# EAGLE design untitled (EAGLE 9.6.2)
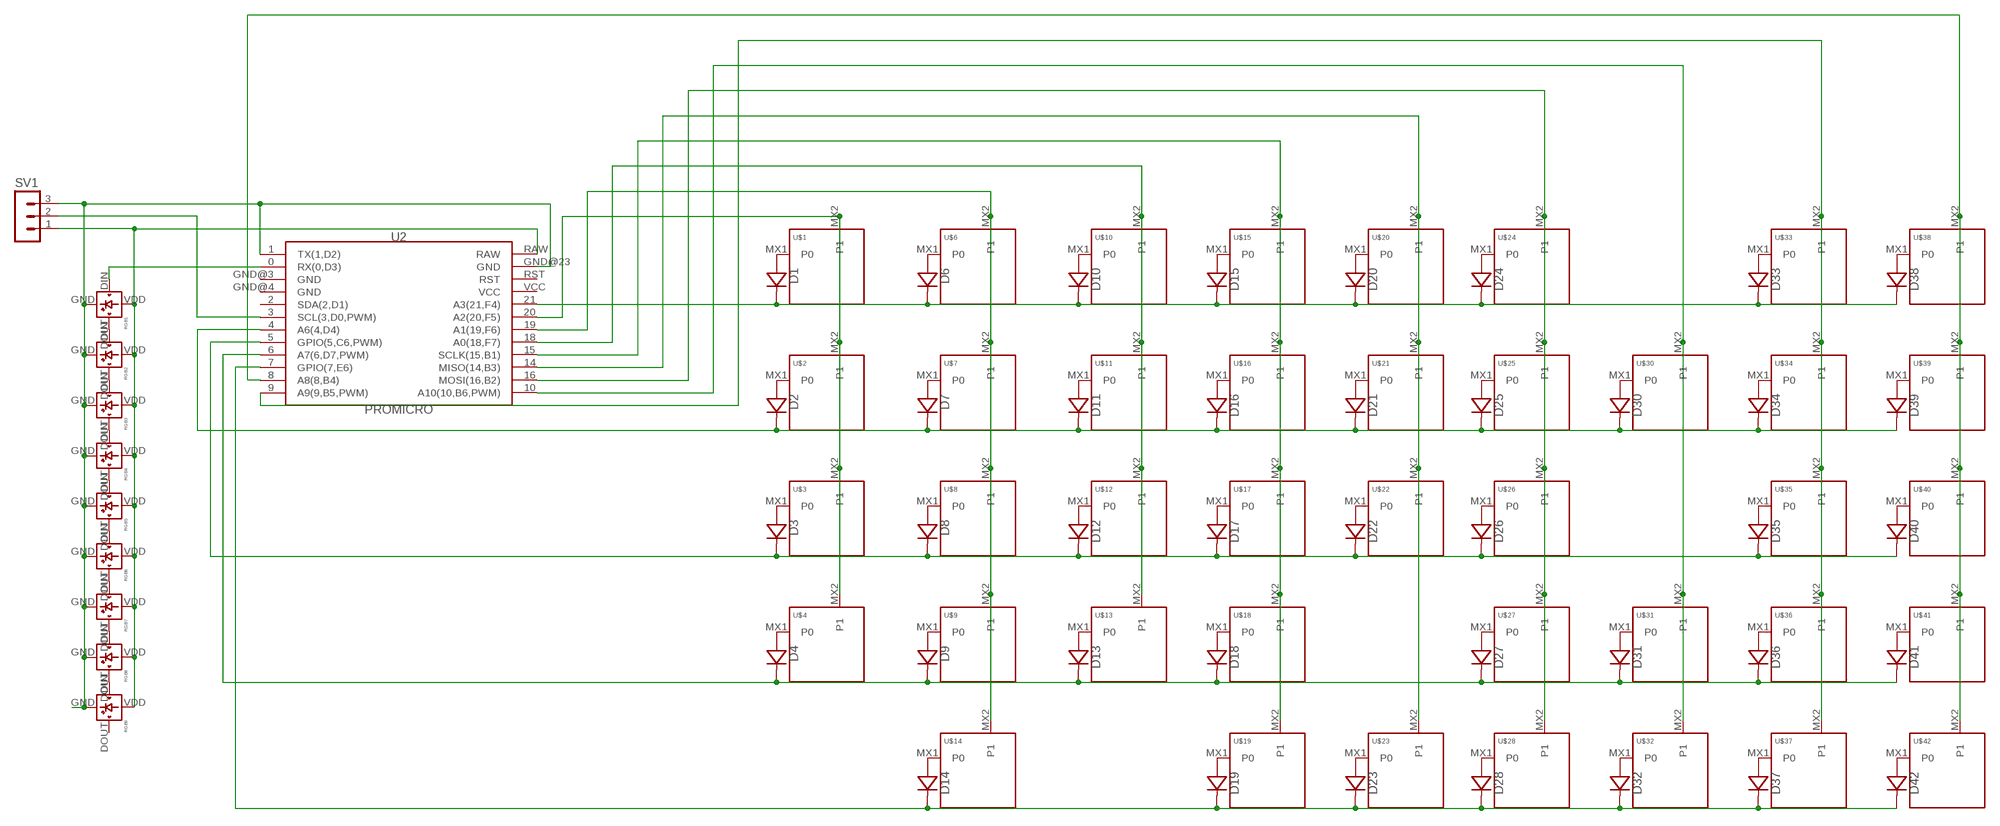
[diagram p0: schematic, sheet 1]

## Parts
D1  DIODE-SOD-123  [SOD-123]
D2  DIODE-SOD-123  [SOD-123]
D3  DIODE-SOD-123  [SOD-123]
D4  DIODE-SOD-123  [SOD-123]
D6  DIODE-SOD-123  [SOD-123]
D7  DIODE-SOD-123  [SOD-123]
D8  DIODE-SOD-123  [SOD-123]
D9  DIODE-SOD-123  [SOD-123]
D10  DIODE-SOD-123  [SOD-123]
D11  DIODE-SOD-123  [SOD-123]
D12  DIODE-SOD-123  [SOD-123]
D13  DIODE-SOD-123  [SOD-123]
D14  DIODE-SOD-123  [SOD-123]
D15  DIODE-SOD-123  [SOD-123]
D16  DIODE-SOD-123  [SOD-123]
D17  DIODE-SOD-123  [SOD-123]
D18  DIODE-SOD-123  [SOD-123]
D19  DIODE-SOD-123  [SOD-123]
D20  DIODE-SOD-123  [SOD-123]
D21  DIODE-SOD-123  [SOD-123]
D22  DIODE-SOD-123  [SOD-123]
D23  DIODE-SOD-123  [SOD-123]
D24  DIODE-SOD-123  [SOD-123]
D25  DIODE-SOD-123  [SOD-123]
D26  DIODE-SOD-123  [SOD-123]
D27  DIODE-SOD-123  [SOD-123]
D28  DIODE-SOD-123  [SOD-123]
D30  DIODE-SOD-123  [SOD-123]
D31  DIODE-SOD-123  [SOD-123]
D32  DIODE-SOD-123  [SOD-123]
D33  DIODE-SOD-123  [SOD-123]
D34  DIODE-SOD-123  [SOD-123]
D35  DIODE-SOD-123  [SOD-123]
D36  DIODE-SOD-123  [SOD-123]
D37  DIODE-SOD-123  [SOD-123]
D38  DIODE-SOD-123  [SOD-123]
D39  DIODE-SOD-123  [SOD-123]
D40  DIODE-SOD-123  [SOD-123]
D41  DIODE-SOD-123  [SOD-123]
D42  DIODE-SOD-123  [SOD-123]
RGB1  WS2812B-MINI  [WS2812B-MINI]
RGB2  WS2812B-MINI  [WS2812B-MINI]
RGB3  WS2812B-MINI  [WS2812B-MINI]
RGB4  WS2812B-MINI  [WS2812B-MINI]
RGB5  WS2812B-MINI  [WS2812B-MINI]
RGB6  WS2812B-MINI  [WS2812B-MINI]
RGB7  WS2812B-MINI  [WS2812B-MINI]
RGB8  WS2812B-MINI  [WS2812B-MINI]
RGB9  WS2812B-MINI  [WS2812B-MINI]
SV1  MA03-1  [MA03-1]
U2  PROMICRO  [PROMICRO]
U$1  KEYSWITCH-PLAIN-MX-1U  [MX-1U]
U$2  KEYSWITCH-PLAIN-MX-1U  [MX-1U]
U$3  KEYSWITCH-PLAIN-MX-1U  [MX-1U]
U$4  KEYSWITCH-PLAIN-MX-1U  [MX-1U]
U$6  KEYSWITCH-PLAIN-MX-1U  [MX-1U]
U$7  KEYSWITCH-PLAIN-MX-1U  [MX-1U]
U$8  KEYSWITCH-PLAIN-MX-1U  [MX-1U]
U$9  KEYSWITCH-PLAIN-MX-1U  [MX-1U]
U$10  KEYSWITCH-PLAIN-MX-1U  [MX-1U]
U$11  KEYSWITCH-PLAIN-MX-1U  [MX-1U]
U$12  KEYSWITCH-PLAIN-MX-1U  [MX-1U]
U$13  KEYSWITCH-PLAIN-MX-1U  [MX-1U]
U$14  KEYSWITCH-PLAIN-MX-1U  [MX-1U]
U$15  KEYSWITCH-PLAIN-MX-1U  [MX-1U]
U$16  KEYSWITCH-PLAIN-MX-1U  [MX-1U]
U$17  KEYSWITCH-PLAIN-MX-1U  [MX-1U]
U$18  KEYSWITCH-PLAIN-MX-1U  [MX-1U]
U$19  KEYSWITCH-PLAIN-MX-1U  [MX-1U]
U$20  KEYSWITCH-PLAIN-MX-1U  [MX-1U]
U$21  KEYSWITCH-PLAIN-MX-1U  [MX-1U]
U$22  KEYSWITCH-PLAIN-MX-1U  [MX-1U]
U$23  KEYSWITCH-PLAIN-MX-1U  [MX-1U]
U$24  KEYSWITCH-PLAIN-MX-1U  [MX-1U]
U$25  KEYSWITCH-PLAIN-MX-1U  [MX-1U]
U$26  KEYSWITCH-PLAIN-MX-1U  [MX-1U]
U$27  KEYSWITCH-PLAIN-MX-1U  [MX-1U]
U$28  KEYSWITCH-PLAIN-MX-1U  [MX-1U]
U$30  KEYSWITCH-PLAIN-MX-1U  [MX-1U]
U$31  KEYSWITCH-PLAIN-MX-1U  [MX-1U]
U$32  KEYSWITCH-PLAIN-MX-1U  [MX-1U]
U$33  KEYSWITCH-PLAIN-MX-1U  [MX-1U]
U$34  KEYSWITCH-PLAIN-MX-1U  [MX-1U]
U$35  KEYSWITCH-PLAIN-MX-1U  [MX-1U]
U$36  KEYSWITCH-PLAIN-MX-1U  [MX-1U]
U$37  KEYSWITCH-PLAIN-MX-1U  [MX-1U]
U$38  KEYSWITCH-PLAIN-MX-1U  [MX-1U]
U$39  KEYSWITCH-PLAIN-MX-1U  [MX-1U]
U$40  KEYSWITCH-PLAIN-MX-1U  [MX-1U]
U$41  KEYSWITCH-PLAIN-MX-1U  [MX-1U]
U$42  KEYSWITCH-PLAIN-MX-1U  [MX-1U]

## Nets
N$1: D1.A U$1.MX1(P0)
N$2: D2.A U$2.MX1(P0)
N$3: D3.A U$3.MX1(P0)
N$4: D4.A U$4.MX1(P0)
N$5: RGB1.DOUT RGB2.DIN
N$6: D6.A U$6.MX1(P0)
N$7: D7.A U$7.MX1(P0)
N$8: D8.A U$8.MX1(P0)
N$9: D9.A U$9.MX1(P0)
N$10: D10.A U$10.MX1(P0)
N$11: D11.A U$11.MX1(P0)
N$12: D12.A U$12.MX1(P0)
N$13: D13.A U$13.MX1(P0)
N$14: D14.A U$14.MX1(P0)
N$15: D15.A U$15.MX1(P0)
N$16: D16.A U$16.MX1(P0)
N$17: D17.A U$17.MX1(P0)
N$18: D18.A U$18.MX1(P0)
N$19: D19.A U$19.MX1(P0)
N$20: D20.A U$20.MX1(P0)
N$21: D21.A U$21.MX1(P0)
N$22: D22.A U$22.MX1(P0)
N$23: D23.A U$23.MX1(P0)
N$24: D24.A U$24.MX1(P0)
N$25: D25.A U$25.MX1(P0)
N$26: D26.A U$26.MX1(P0)
N$27: D27.A U$27.MX1(P0)
N$28: D28.A U$28.MX1(P0)
N$29: RGB2.DOUT RGB3.DIN
N$30: D30.A U$30.MX1(P0)
N$31: D31.A U$31.MX1(P0)
N$32: D32.A U$32.MX1(P0)
N$33: D33.A U$33.MX1(P0)
N$34: D34.A U$34.MX1(P0)
N$35: D35.A U$35.MX1(P0)
N$36: D36.A U$36.MX1(P0)
N$37: D37.A U$37.MX1(P0)
N$38: D38.A U$38.MX1(P0)
N$39: D39.A U$39.MX1(P0)
N$40: D40.A U$40.MX1(P0)
N$41: D41.A U$41.MX1(P0)
N$42: D42.A U$42.MX1(P0)
N$43: U2.20(A2(20,F5)) U$1.MX2(P1) U$2.MX2(P1) U$3.MX2(P1) U$4.MX2(P1)
N$44: U2.19(A1(19,F6)) U$6.MX2(P1) U$7.MX2(P1) U$8.MX2(P1) U$9.MX2(P1) U$14.MX2(P1)
N$45: U2.18(A0(18,F7)) U$10.MX2(P1) U$11.MX2(P1) U$12.MX2(P1) U$13.MX2(P1)
N$46: U2.15(SCLK(15,B1)) U$15.MX2(P1) U$16.MX2(P1) U$17.MX2(P1) U$18.MX2(P1) U$19.MX2(P1)
N$47: U2.14(MISO(14,B3)) U$20.MX2(P1) U$21.MX2(P1) U$22.MX2(P1) U$23.MX2(P1)
N$48: U2.16(MOSI(16,B2)) U$24.MX2(P1) U$25.MX2(P1) U$26.MX2(P1) U$27.MX2(P1) U$28.MX2(P1)
N$49: U2.10(A10(10,B6,PWM)) U$30.MX2(P1) U$31.MX2(P1) U$32.MX2(P1)
N$50: U2.9(A9(9,B5,PWM)) U$33.MX2(P1) U$34.MX2(P1) U$35.MX2(P1) U$36.MX2(P1) U$37.MX2(P1)
N$51: D1.C D6.C D10.C D15.C D20.C D24.C D33.C D38.C U2.21(A3(21,F4))
N$52: D2.C D7.C D11.C D16.C D21.C D25.C D30.C D34.C D39.C U2.4(A6(4,D4))
N$53: D3.C D8.C D12.C D17.C D22.C D26.C D35.C D40.C U2.5(GPIO(5,C6,PWM))
N$54: D4.C D9.C D13.C D18.C D27.C D31.C D36.C D41.C U2.6(A7(6,D7,PWM))
N$55: D14.C D19.C D23.C D28.C D32.C D37.C D42.C U2.7(GPIO(7,E6))
N$56: U2.8(A8(8,B4)) U$38.MX2(P1) U$39.MX2(P1) U$40.MX2(P1) U$41.MX2(P1) U$42.MX2(P1)
N$57: RGB3.DOUT RGB4.DIN
N$58: RGB4.DOUT RGB5.DIN
N$59: RGB5.DOUT RGB6.DIN
N$60: RGB6.DOUT RGB7.DIN
N$61: RGB7.DOUT RGB8.DIN
N$62: RGB8.DOUT RGB9.DIN
N$63: RGB1.VDD RGB2.VDD RGB3.VDD RGB4.VDD RGB5.VDD RGB6.VDD RGB7.VDD RGB8.VDD RGB9.VDD SV1.1 U2.RAW
N$64: RGB1.GND RGB2.GND RGB3.GND RGB4.GND RGB5.GND RGB6.GND RGB7.GND RGB8.GND RGB9.GND SV1.3 U2.1(TX(1,D2)) U2.GND@23(GND)
N$65: RGB1.DIN U2.0(RX(0,D3))
N$66: SV1.2 U2.3(SCL(3,D0,PWM))
Unconnected: RGB9.DOUT U2.2(SDA(2,D1)) U2.GND@3(GND) U2.GND@4(GND) U2.RST U2.VCC

## Library data of the parts
D1-D4 D6-D28 D30-D42 = Controller:DIODE: Standard 1N4148 diode
RGB1-RGB9 = Controller:WS2812B
SV1 = con-lstb:MA03-1: PIN HEADER; OC_FARNELL: unknown; OC_NEWARK: unknown
U2 = Controller:PROMICRO
U$1-U$4 U$6-U$28 U$30-U$42 = Keyboard:KEYSWITCH-PLAIN

## Board
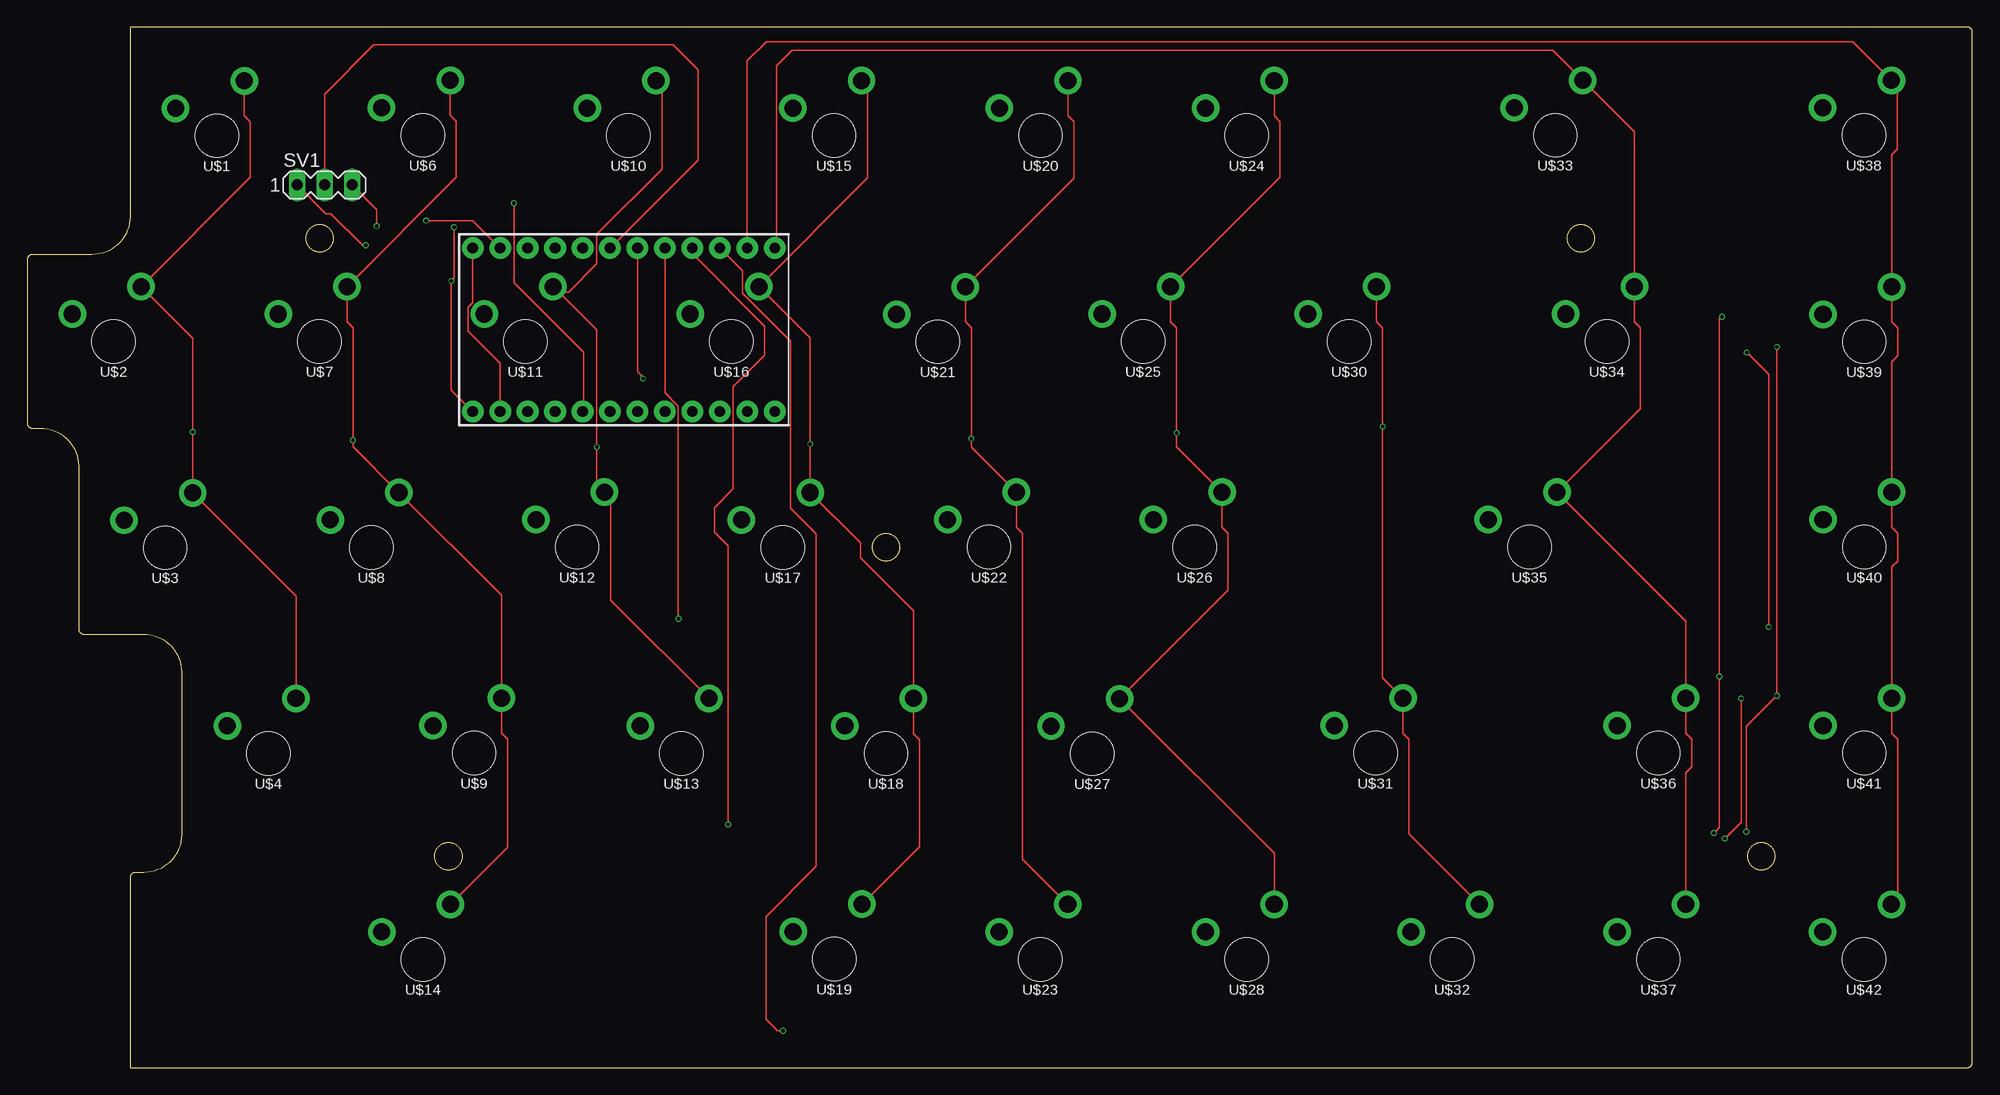
[diagram p1: board, top side]
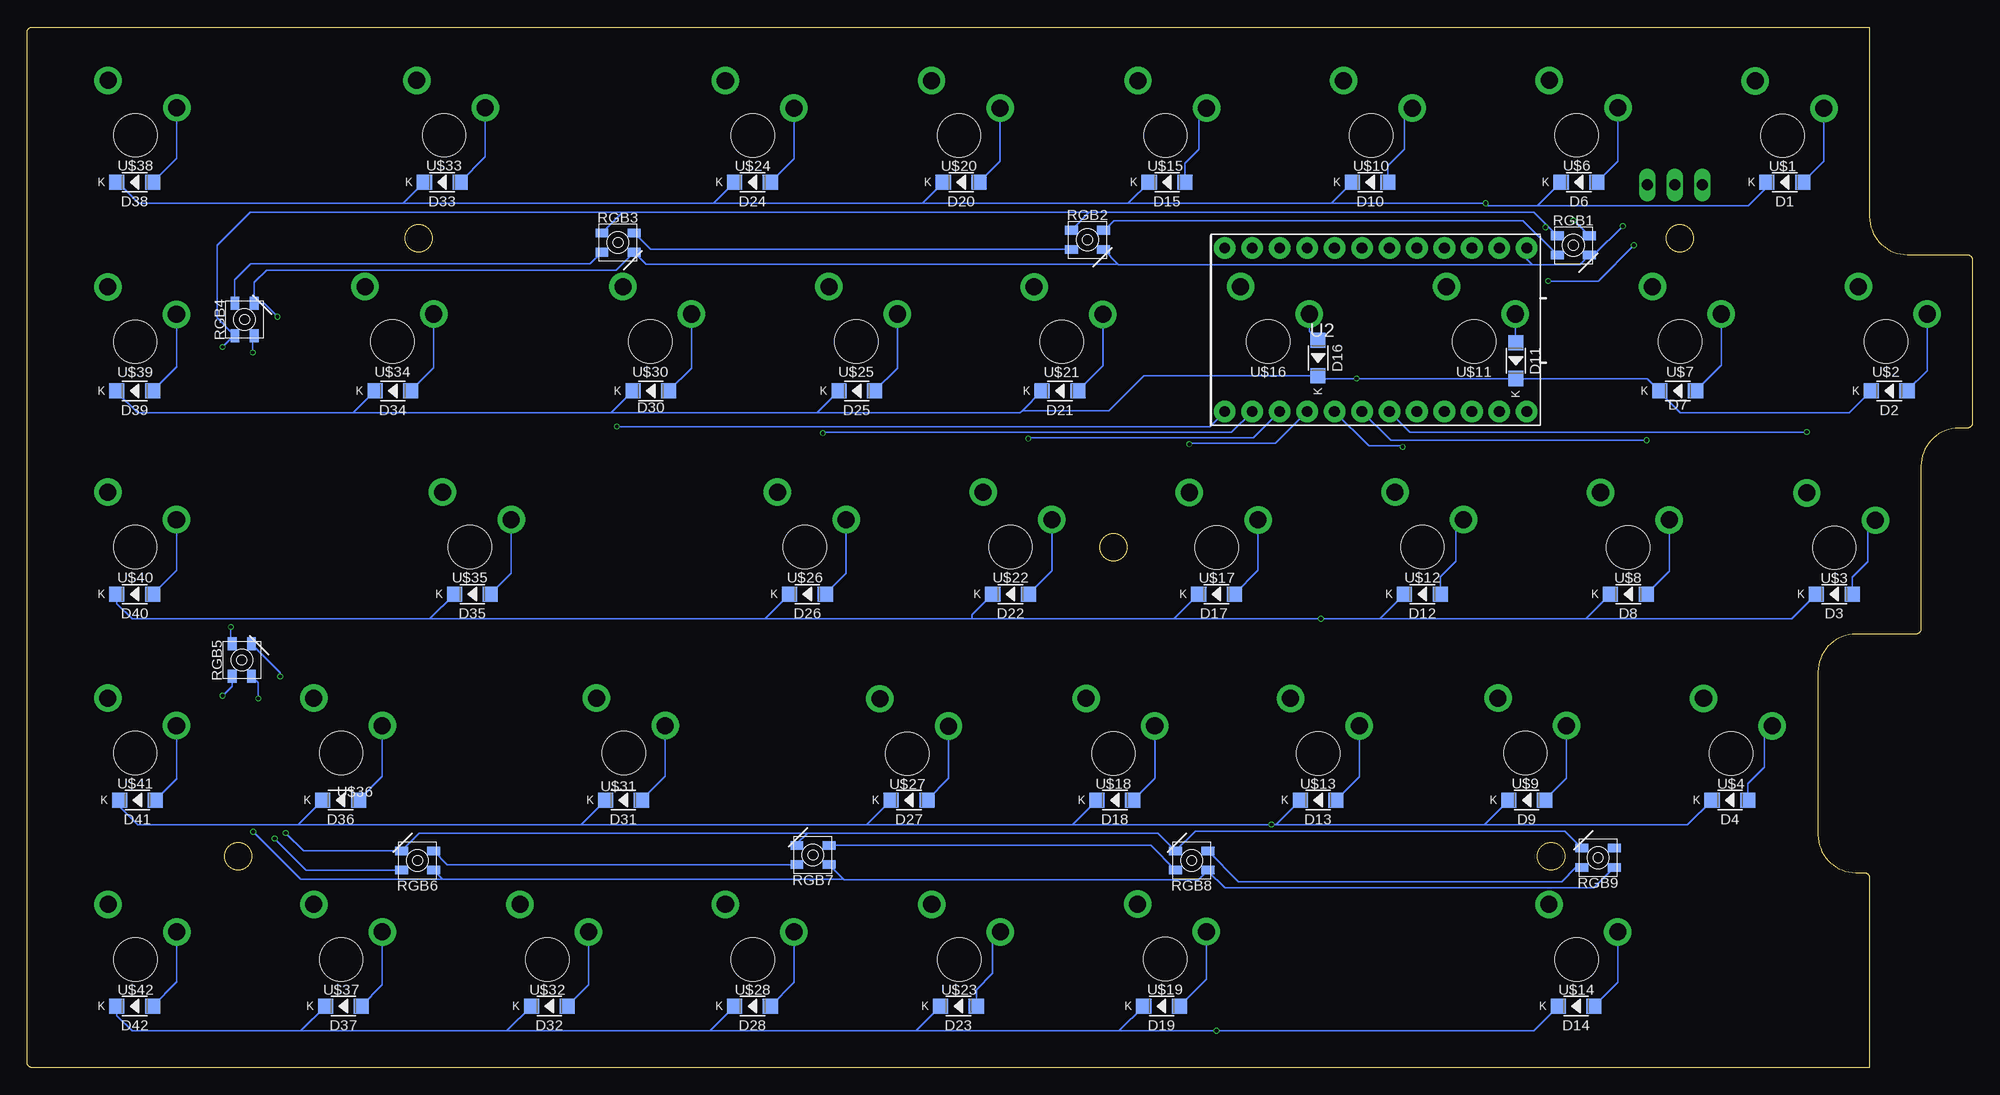
[diagram p2: board, bottom side, seen from below]

Size 179.98 x 96.25 mm. Coordinates in mm from the lower left corner, seen from the top.
Outline: 179.45,96.25 9.53,96.25 9.53,78.7 arc-90 6.03,75.2 0.5,75.2 arc90 0,74.7 0,59.65 arc90 0.5,59.15 1.26,59.15 arc-90 4.76,55.65 4.76,40.6 arc90 5.26,40.1 10.79,40.1 arc-90 14.29,36.6 14.29,21.55 arc-90 10.79,18.05 10.03,18.05 arc90 9.53,17.55 9.53,0 179.45,0 179.52,0 179.56,0.01 179.59,0.01 179.63,0.02 179.67,0.04 179.71,0.06 179.74,0.07 179.77,0.09 179.8,0.12 179.83,0.14 179.85,0.17 179.88,0.21 179.9,0.24 179.92,0.27 179.94,0.31 179.95,0.35 179.96,0.38 179.97,0.42 179.97,0.46 179.98,0.53 179.98,95.72 179.97,95.79 179.97,95.83 179.96,95.87 179.95,95.9 179.94,95.94 179.92,95.98 179.9,96.01 179.88,96.04 179.85,96.08 179.83,96.1 179.8,96.13 179.77,96.15 179.74,96.17 179.71,96.19 179.67,96.21 179.63,96.22 179.59,96.23 179.55,96.24 179.52,96.25 179.45,96.25
Outline: circle at 27.07,76.7 radius 1.25
Outline: circle at 143.76,76.7 radius 1.25
Outline: circle at 160.43,19.55 radius 1.25
Outline: circle at 38.98,19.55 radius 1.25
Outline: circle at 79.46,48.12 radius 1.25
Copper layers (1*16): Top 0.035559375mm / dielectric 1.6mm / Bottom 0.035559375mm
Design rules "jlcpcb2layer": minimum track width 5mil, minimum drill 12mil, track to track 5mil, track to pad 5mil, pad to pad 5mil, via to via 5mil, smd to smd 5mil, copper to edge 8mil, drill to drill 6mil, minimum pad ring 5mil, minimum via ring 3mil, stop-mask expansion 2.5mil, vias tented up to drill 0mil, thermal gap 10mil

### Footprints (pad centres in the part's own frame; a part is rotated, then mirrored left to right if it is on the bottom)
SOD-123 = smd 1.397 x 1.397: A -1.651,0; C 1.651,0
WS2812B-MINI = smd 0.8 x 1.2: DIN 0.89,-1.49; DOUT -0.89,1.49; GND -0.89,-1.49; VDD 0.89,1.49
MA03-1 = drill 1.016 long: 1 -2.54,0; 2 0,0; 3 2.54,0
PROMICRO = drill 1 pad 2: 0 -7.62,11.43; 1 -7.62,13.97; 2 -7.62,3.81; 3 -7.62,1.27; 4 -7.62,-1.27; 5 -7.62,-3.81; 6 -7.62,-6.35; 7 -7.62,-8.89; 8 -7.62,-11.43; 9 -7.62,-13.97; 10 7.5,-13.97; 14 7.5,-8.89; 15 7.5,-6.35; 16 7.5,-11.43; 18 7.5,-3.81; 19 7.5,-1.27; 20 7.5,1.27; 21 7.5,3.81; GND@3 -7.62,8.89; GND@4 -7.62,6.35; GND@23 7.5,11.43; RAW 7.5,13.97; RST 7.5,8.89; VCC 7.5,6.35
MX-1U = drill 1.575 pad 2.54: MX1 -3.81,2.54; MX2 2.54,5.08 | hole 4: 0,0

### Placement (x,y rotation side)
D1  17.36,81.9 180 bottom
D2  7.71,62.6 180 bottom
D3  12.79,43.8 180 bottom
D4  22.44,24.75 180 bottom
D6  36.41,81.9 180 bottom
D7  27.26,62.6 180 bottom
D8  31.84,43.8 180 bottom
D9  41.23,24.75 180 bottom
D10  55.71,81.9 180 bottom
D11  42.25,65.39 270 bottom
D12  50.89,43.8 180 bottom
D13  60.54,24.75 180 bottom
D14  36.66,5.7 180 bottom
D15  74.51,81.9 180 bottom
D16  60.54,65.64 270 bottom
D17  69.94,43.8 180 bottom
D18  79.33,24.75 180 bottom
D19  75.02,5.7 180 bottom
D20  93.56,81.9 180 bottom
D21  84.41,62.6 180 bottom
D22  88.99,43.8 180 bottom
D23  93.81,5.7 180 bottom
D24  112.86,81.9 180 bottom
D25  103.21,62.6 180 bottom
D26  107.78,43.8 180 bottom
D27  98.38,24.75 180 bottom
D28  112.86,5.7 180 bottom
D30  122.26,62.6 180 bottom
D31  124.8,24.75 180 bottom
D32  131.66,5.7 180 bottom
D33  141.56,81.9 180 bottom
D34  146.14,62.6 180 bottom
D35  138.77,43.8 180 bottom
D36  150.96,24.75 180 bottom
D37  150.71,5.7 180 bottom
D38  170.01,81.9 180 bottom
D39  170.01,62.6 180 bottom
D40  170.01,43.8 180 bottom
D41  169.76,24.75 180 bottom
D42  170.01,5.7 180 bottom
RGB1  36.92,76.06 90 bottom
RGB2  81.87,76.57 90 bottom
RGB3  125.31,76.31 90 bottom
RGB4  159.85,69.2 180 bottom
RGB5  160.11,37.7 180 bottom
RGB6  143.85,19.16 270 bottom
RGB7  107.27,19.67 270 bottom
RGB8  72.22,19.16 270 bottom
RGB9  34.63,19.42 270 bottom
SV1  27.52,81.65 0 top
U2  55.2,68.18 270 bottom
U$1  17.56,86.19 0 top
U$2  8.01,67.17 0 top
U$3  12.79,48.09 0 top
U$4  22.34,29.07 0 top
U$6  36.61,86.24 0 top
U$7  27.06,67.17 0 top
U$8  31.86,48.12 0 top
U$9  41.36,29.09 0 top
U$10  55.64,86.22 0 top
U$11  46.11,67.17 0 top
U$12  50.89,48.14 0 top
U$13  60.54,29.07 0 top
U$14  36.64,10.02 0 top
U$15  74.66,86.22 0 top
U$16  65.16,67.17 0 top
U$17  69.91,48.12 0 top
U$18  79.46,29.07 0 top
U$19  74.69,10.04 0 top
U$20  93.76,86.22 0 top
U$21  84.26,67.14 0 top
U$22  88.99,48.14 0 top
U$23  93.74,10.02 0 top
U$24  112.84,86.22 0 top
U$25  103.26,67.17 0 top
U$26  108.01,48.14 0 top
U$27  98.54,29.04 0 top
U$28  112.84,10.02 0 top
U$30  122.31,67.17 0 top
U$31  124.75,29.09 0 top
U$32  131.84,10.02 0 top
U$33  141.39,86.24 0 top
U$34  146.16,67.17 0 top
U$35  139,48.14 0 top
U$36  150.91,29.09 0 top
U$37  150.91,10.02 0 top
U$38  169.94,86.24 0 top
U$39  169.96,67.14 0 top
U$40  169.96,48.14 0 top
U$41  169.96,29.09 0 top
U$42  169.94,10.02 0 top

### Tracks (layer width: path | path; a pad name or v marks a point on that pad's centre or on a via)
N$1
  Bottom 0.152: U$1.MX1 13.75,83.86 D1.A
N$2
  Bottom 0.152: U$2.MX1 4.2,64.45 D2.A
N$3
  Bottom 0.152: D3.A 11.14,45.37 9.69,46.81 9.69,49.92 U$3.MX1
N$4
  Bottom 0.152: D4.A 20.79,26.24 19.24,27.79 19.24,30.89 U$4.MX1
N$5
  Bottom 0.152: RGB2.DIN 80.38,77.36 79.4,78.34 41.58,78.34 RGB1.DOUT
N$6
  Bottom 0.152: U$6.MX1 32.8,83.86 D6.A
N$7
  Bottom 0.152: U$7.MX1 23.25,64.96 D7.A
N$8
  Bottom 0.152: U$8.MX1 28.05,45.93 D8.A
N$9
  Bottom 0.152: U$9.MX1 37.55,26.78 D9.A
N$10
  Bottom 0.152: D10.A 54.06,83.42 52.54,84.94 52.54,88.04 U$10.MX1
N$11
  Bottom 0.152: U$11.MX1 42.3,67.09 D11.A
N$12
  Bottom 0.152: D12.A 49.24,45.42 47.79,46.86 47.79,49.97 U$12.MX1
N$13
  Bottom 0.152: U$13.MX1 56.73,26.91 D13.A
N$14
  Bottom 0.152: U$14.MX1 32.83,7.88 D14.A
N$15
  Bottom 0.152: D15.A 72.86,83.65 71.57,84.94 71.57,88.04 U$15.MX1
N$16
  Bottom 0.152: U$16.MX1 61.35,68.11 D16.A
N$17
  Bottom 0.152: U$17.MX1 66.1,45.98 D17.A
N$18
  Bottom 0.152: U$18.MX1 75.65,26.78 D18.A
N$19
  Bottom 0.152: U$19.MX1 70.88,8.19 D19.A
N$20
  Bottom 0.152: U$20.MX1 89.95,83.86 D20.A
N$21
  Bottom 0.152: U$21.MX1 80.45,64.91 D21.A
N$22
  Bottom 0.152: U$22.MX1 85.18,45.96 D22.A
N$23
  Bottom 0.152: D23.A 92.16,7.22 90.64,8.74 90.64,11.84 U$23.MX1
N$24
  Bottom 0.152: U$24.MX1 109.03,84.08 D24.A
N$25
  Bottom 0.152: U$25.MX1 99.45,64.7 D25.A
N$26
  Bottom 0.152: U$26.MX1 104.2,45.73 D26.A
N$27
  Bottom 0.152: U$27.MX1 94.73,26.76 D27.A
N$28
  Bottom 0.152: U$28.MX1 109.03,7.88 D28.A
N$29
  Bottom 0.152: RGB2.DOUT 122.29,75.68 RGB3.DIN
N$30
  Bottom 0.152: U$30.MX1 118.5,64.7 D30.A
N$31
  Bottom 0.152: U$31.MX1 120.94,26.96 D31.A
N$32
  Bottom 0.152: U$32.MX1 128.03,7.68 D32.A
N$33
  Bottom 0.152: U$33.MX1 137.58,84.24 D33.A
N$34
  Bottom 0.152: U$34.MX1 142.35,64.73 D34.A
N$35
  Bottom 0.152: U$35.MX1 135.19,45.73 D35.A
N$36
  Bottom 0.152: U$36.MX1 147.1,26.96 D36.A
N$37
  Bottom 0.152: U$37.MX1 147.1,7.66 D37.A
N$38
  Bottom 0.152: U$38.MX1 166.13,84.14 D38.A
N$39
  Bottom 0.152: U$39.MX1 166.15,64.81 D39.A
N$40
  Bottom 0.152: U$40.MX1 166.15,46.01 D40.A
N$41
  Bottom 0.152: U$41.MX1 166.15,26.71 D41.A
N$42
  Bottom 0.152: U$42.MX1 166.13,7.94 D42.A
N$43  (via drill 0.35)
  Top 0.152: U$1.MX2 20.1,88.03 20.65,87.47 20.65,82.35 U$2.MX2 15.33,67.47 v15.33,58.79 U$3.MX2 24.88,43.62 U$4.MX2
  Bottom 0.152: U2.20 52.04,58.79 v15.33,58.79
N$44  (via drill 0.35)
  Top 0.152: U$6.MX2 39.15,88.08 39.7,87.52 39.7,82.35 U$7.MX2 29.6,69 30.15,68.45 v30.15,58.02 30.15,57.45 U$8.MX2 43.9,43.7 U$9.MX2 43.9,30.93 44.45,30.37 44.45,20.38 U$14.MX2
  Bottom 0.152: U2.19 53.81,58.02 v30.15,58.02
N$45  (via drill 0.35)
  Top 0.152: U$10.MX2 58.73,90.75 58.73,83.1 52.71,77.08 52.71,74.36 50.08,71.74 49.16,71.74 U$11.MX2 48.71,72.25 52.71,68.25 v52.71,57.42 52.71,54.33 53.25,53.79 53.25,53.48 53.43,53.48 U$12.MX2 53.43,52.77 53.98,52.22 53.98,43.25 U$13.MX2
  Bottom 0.152: U2.18 55.85,57.52 52.66,57.52 52.66,57.46 v52.71,57.42
N$46  (via drill 0.35)
  Top 0.152: U$15.MX2 77.26,91.3 77.75,90.8 77.75,82.3 U$16.MX2 72.45,67.5 v72.45,57.67 U$17.MX2 77.12,48.53 77.12,47.15 82,42.27 U$18.MX2 82,30.9 82.55,30.35 82.55,20.45 U$19.MX2
  Bottom 0.152: U2.15 64.47,57.77 72.48,57.77 72.48,57.7 v72.45,57.67
N$47  (via drill 0.35)
  Top 0.152: U$20.MX2 96.3,88.05 96.85,87.5 96.85,82.27 U$21.MX2 86.8,68.98 87.35,68.42 v87.35,58.18 87.35,57.4 U$22.MX2 91.53,49.98 92.08,49.42 92.08,19.3 U$23.MX2
  Bottom 0.152: U2.14 66.5,58.28 87.46,58.28 87.36,58.18 v87.35,58.18
N$48  (via drill 0.35)
  Top 0.152: U$24.MX2 115.38,88.05 115.93,87.5 115.93,82.38 U$25.MX2 105.8,69 106.35,68.45 v106.35,58.69 106.35,57.42 U$26.MX2 110.55,49.98 111.1,49.42 111.1,44.15 U$27.MX2 115.38,19.82 U$28.MX2
  Bottom 0.152: U2.16 68.53,58.79 106.26,58.79 v106.35,58.69
N$49  (via drill 0.35)
  Top 0.152: U$30.MX2 124.85,69 125.4,68.45 v125.4,59.29 125.4,36.06 U$31.MX2 127.29,30.93 127.84,30.37 127.84,21.63 U$32.MX2
  Bottom 0.152: U2.10 70.56,59.29 v125.4,59.29
N$50
  Top 0.152: U$37.MX2 153.45,27.26 154,27.81 154,30.37 153.45,30.93 U$36.MX2 153.45,41.31 U$35.MX2 149.25,60.94 149.25,68.45 148.7,69 U$34.MX2 148.7,86.55 U$33.MX2 141.16,94.09 70.76,94.09 69.35,92.68 69.35,75.98 U2.9
N$51  (via drill 0.35)
  Top 0.152: U2.21 51.49,60.78 51.49,66.16 45.04,72.61 v45.04,79.96
  Bottom 0.152: D38.C 171.61,81.9 169.66,79.96 145.16,79.96 | D1.C 19.01,81.45 20.76,79.7 40.26,79.7 | 40.26,79.7 44.79,79.7 v45.04,79.96 59.31,79.96 | 59.31,79.96 78.06,79.96 | 78.06,79.96 97.15,79.96 | 97.15,79.96 116.46,79.96 | 116.46,79.96 145.16,79.96 | D6.C 40.26,79.7 | D10.C 59.31,79.96 | D15.C 78.06,80 78.06,79.96 | D20.C 97.15,79.96 | D24.C 116.46,79.96 | D33.C 145.16,79.96
N$52  (via drill 0.35)
  Top 0.152: U2.4 56.47,64.37 56.98,63.87 v56.98,63.74
  Bottom 0.152: D2.C 11.39,60.56 27.01,60.56 28.92,62.47 D7.C 30.06,63.74 D11.C v56.98,63.74 60.28,63.74 D16.C 76.67,63.99 79.91,60.76 87.91,60.76 | 106.89,60.56 88.1,60.56 87.91,60.76 | 106.89,60.56 125.94,60.56 | 125.94,60.56 149.82,60.56 | 149.82,60.56 169.76,60.56 171.66,62.47 D39.C | D21.C 87.91,60.76 | D25.C 106.89,60.56 | D30.C 125.94,60.56 | D34.C 149.82,60.56
N$53  (via drill 0.35)
  Top 0.152: U2.5 59.01,62.42 60.24,61.19 60.24,41.56 v60.28,41.51
  Bottom 0.152: D3.C 16.72,41.51 35.77,41.51 | 35.77,41.51 54.82,41.51 | 54.82,41.51 v60.28,41.51 73.87,41.51 | 73.87,41.51 92.54,41.51 | 92.54,41.51 111.72,41.51 | 111.72,41.51 142.71,41.51 | 142.71,41.51 170.27,41.51 171.66,42.91 D40.C | D35.C 142.71,41.51 | D26.C 111.72,41.51 | D22.C 92.54,41.9 92.54,41.51 | D17.C 73.87,41.51 | D12.C 54.82,41.51 | D8.C 35.77,41.51
N$54  (via drill 0.35)
  Top 0.152: U2.6 61.55,75.3 68.25,68.6 68.25,65.89 65.32,62.96 65.32,53.52 63.59,51.79 63.59,49.53 64.86,48.26 v64.86,22.5
  Bottom 0.152: D4.C 26.38,22.46 45.17,22.46 | 45.17,22.46 64.48,22.46 | 64.48,22.46 83.27,22.46 | 83.27,22.46 102.32,22.46 | 102.32,22.46 128.74,22.46 | 128.74,22.46 154.9,22.46 | 154.9,22.46 169.76,22.46 171.41,24.12 D41.C | D36.C 154.9,22.46 | D31.C 128.74,22.46 | D27.C 102.32,22.46 | D18.C 83.27,22.46 | D13.C 64.41,22.53 | 64.41,22.53 64.48,22.46 | D9.C 45.17,22.46 | 64.41,22.53 64.83,22.53 v64.86,22.5
N$55  (via drill 0.35)
  Top 0.152: U2.7 66.2,73.7 66.2,71.63 70.66,67.17 70.66,51.75 73,49.4 73,18.61 68.36,13.97 68.36,4.48 69.43,3.41 v69.94,3.41
  Bottom 0.152: D14.C 40.6,3.41 v69.94,3.41 78.95,3.41 | 78.95,3.41 97.75,3.41 | 97.75,3.41 116.8,3.41 | 116.8,3.41 135.6,3.41 | 135.6,3.41 154.65,3.41 | 154.65,3.41 170.27,3.41 171.66,4.81 D42.C | D37.C 154.65,3.41 | D32.C 135.6,3.41 | D28.C 116.8,3.41 | D23.C 97.75,3.41 | D19.C 78.95,3.41
N$56
  Top 0.152: U$42.MX2 173.05,15.68 173.05,30.37 172.5,30.93 U$41.MX2 172.5,46.31 173.05,46.86 173.05,49.42 172.5,49.98 U$40.MX2 172.5,65.31 173.05,65.86 173.05,68.42 172.5,68.98 U$39.MX2 172.5,84.44 173.03,84.96 173.03,90.77 U$38.MX2 168.9,94.9 68.41,94.9 66.63,93.12 U2.8
N$57
  Bottom 0.152: RGB3.DOUT 127.86,74.36 159.27,74.36 160.74,72.88 RGB4.DIN
N$58  (via drill 0.35)
  Top 0.152: v159.09,66.15 161.12,64.12 v161.12,40.75
  Bottom 0.152: RGB4.DOUT 159.09,67.58 v159.09,66.15 | v161.12,40.75 161.12,39.32 RGB5.DIN
N$59  (via drill 0.35)
  Top 0.152: v157.06,21.19 158.58,22.72 v158.58,34.15
  Bottom 0.152: RGB6.DIN 154.14,18.27 v157.06,21.19 | v158.58,34.15 158.58,35.58 RGB5.DOUT
N$60
  Bottom 0.152: RGB7.DIN 141.09,18.78 RGB6.DOUT
N$61
  Bottom 0.152: RGB8.DIN 76,20.56 RGB7.DOUT
N$62
  Bottom 0.152: RGB9.DIN 36.68,18.53 38,17.21 67.89,17.21 RGB8.DOUT
N$63  (via drill 0.35)
  Top 0.152: v159.06,21.83 159.06,31.58 v161.88,34.4 v161.88,66.66 | v39.5,77.74 39.5,73.01 v39.25,72.76 39.25,62.67 U2.RAW | SV1.1 27.65,78.98 28.11,78.98 31.03,76.06 v31.33,76.06
  Bottom 0.152: RGB9.VDD 35.04,16.62 69.17,16.62 70.73,18.18 RGB8.VDD 71.62,17.38 104.39,17.38 104.43,17.43 | 104.43,17.43 RGB7.VDD | 104.43,17.43 141.52,17.43 | RGB6.VDD 141.52,17.43 | 39.5,78.04 40.56,79.11 81.71,79.11 | 39.5,78.04 RGB1.VDD | 81.71,79.11 RGB2.VDD | 81.71,79.11 124.89,79.11 | 124.89,79.11 RGB3.VDD | 124.89,79.11 159.34,79.11 162.39,76.06 162.39,69.36 RGB4.VDD 160.83,67.71 v161.88,66.66 | 141.52,17.43 154.66,17.43 v159.06,21.83 | v161.88,34.4 161,35.29 RGB5.VDD | 39.5,78.04 v39.5,77.74 | v31.33,76.06 34.63,72.76 v39.25,72.76
N$64  (via drill 0.35)
  Top 0.152: v156.04,21.7 156.55,22.21 v156.55,36.18 156.55,69.2 v156.8,69.45 | U2.GND@23 43.77,65.13 40.8,68.1 40.8,70.33 41.23,70.76 U2.1 | SV1.3 32.34,79.36 v32.34,77.84
  Bottom 0.152: RGB9.GND 37.71,21.89 71.87,21.89 RGB8.GND 75.36,21.7 107.78,21.7 | 107.78,21.7 108.76,20.72 RGB7.GND | 107.78,21.7 143.69,21.7 RGB6.GND 154.39,20.05 v156.04,21.7 | 79.03,74.33 78.99,74.28 40.73,74.28 | 79.03,74.33 RGB2.GND | 40.73,74.28 36.31,74.28 RGB1.GND 35.01,75.17 v32.34,77.84 | 79.03,74.33 122.72,74.33 RGB3.GND 125.47,73.77 157.82,73.77 158.96,72.63 RGB4.GND 158.04,70.69 v156.8,69.45 | RGB5.GND 156.55,36.53 v156.55,36.18 | 40.73,74.28 41.23,74.79 U2.1
N$65  (via drill 0.35)
  Top 0.152: v36.92,78.34 41.23,78.34 U2.0
  Bottom 0.152: RGB1.DIN 36.82,78.34 v36.92,78.34
N$66
  Top 0.152: SV1.2 27.52,90.03 32.09,94.6 59.78,94.6 62.06,92.31 62.06,83.93 U2.3